# EAGLE schematic odd_v1 (EAGLE 6.2)
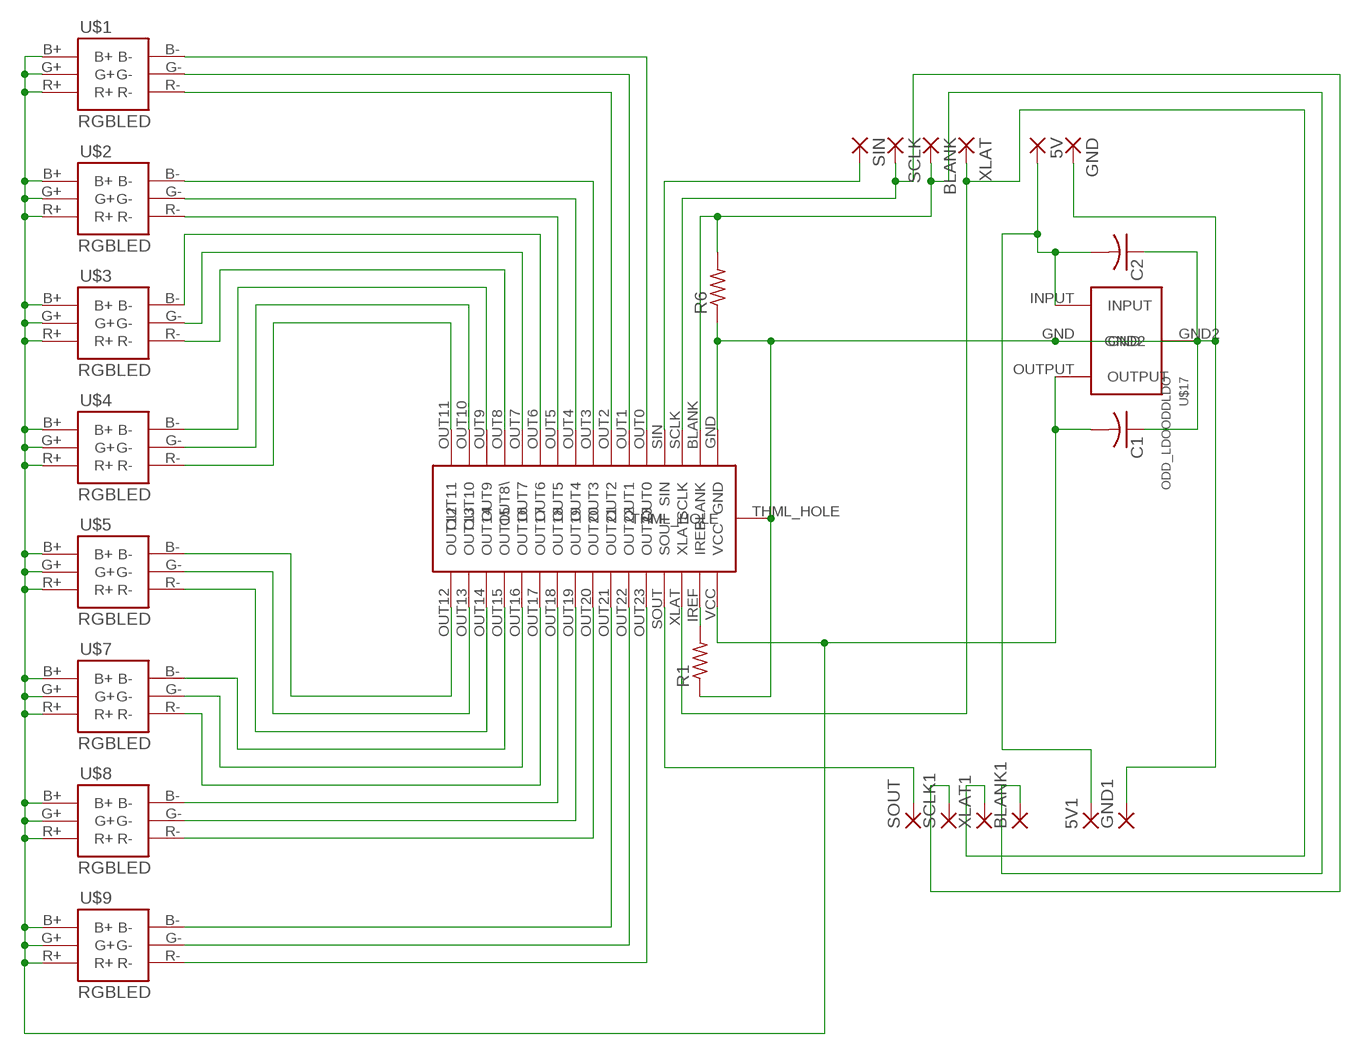
[diagram p0: schematic, sheet 1]

## Parts
5V  2,54/1,1  [2,54/1,1]
5V1  2,54/1,1  [2,54/1,1]
BLANK  2,54/1,1  [2,54/1,1]
BLANK1  2,54/1,1  [2,54/1,1]
C1  C-US050-025X075  [C050-025X075]
C2  C-US050-025X075  [C050-025X075]
GND  2,54/1,1  [2,54/1,1]
GND1  2,54/1,1  [2,54/1,1]
R1  R-US_0204/7  [0204/7]
R6  R-US_0204/7  [0204/7]
SCLK  2,54/1,1  [2,54/1,1]
SCLK1  2,54/1,1  [2,54/1,1]
SIN  2,54/1,1  [2,54/1,1]
SOUT  2,54/1,1  [2,54/1,1]
U$1  RGBLED  CREESMDRGBLED6PADSMD  [6PADSMD]
U$2  RGBLED  CREESMDRGBLED6PADSMD  [6PADSMD]
U$3  RGBLED  CREESMDRGBLED6PADSMD  [6PADSMD]
U$4  RGBLED  CREESMDRGBLED6PADSMD  [6PADSMD]
U$5  RGBLED  CREESMDRGBLED6PADSMD  [6PADSMD]
U$6  TLC5947  [32_SMD]
U$7  RGBLED  CREESMDRGBLED6PADSMD  [6PADSMD]
U$8  RGBLED  CREESMDRGBLED6PADSMD  [6PADSMD]
U$9  RGBLED  CREESMDRGBLED6PADSMD  [6PADSMD]
U$17  ODD_LDOODDLDO  [4PINLDO]
XLAT  2,54/1,1  [2,54/1,1]
XLAT1  2,54/1,1  [2,54/1,1]

## Nets
N$2: U$1.B- U$6.OUT0
N$3: U$1.G- U$6.OUT1
N$4: U$1.R- U$6.OUT2
N$5: U$6.OUT23 U$9.R-
N$6: U$6.OUT22 U$9.G-
N$7: U$6.OUT21 U$9.B-
N$8: U$6.OUT20 U$8.R-
N$9: U$6.OUT19 U$8.G-
N$10: U$6.OUT18 U$8.B-
N$11: U$6.OUT17 U$7.R-
N$12: U$6.OUT16 U$7.G-
N$13: U$6.OUT15 U$7.B-
N$14: U$5.R- U$6.OUT14
N$15: U$5.G- U$6.OUT13
N$16: U$5.B- U$6.OUT12
N$17: U$2.B- U$6.OUT3
N$18: U$6.XLAT XLAT1.1(P) XLAT.1(P)
N$19: U$2.G- U$6.OUT4
N$20: U$2.R- U$6.OUT5
N$21: U$3.B- U$6.OUT6
N$22: U$3.G- U$6.OUT7
N$23: U$3.R- U$6.OUT8(OUT8\)
N$24: U$4.B- U$6.OUT9
N$25: U$4.G- U$6.OUT10
N$26: U$4.R- U$6.OUT11
N$27: C1.2 U$1.B+ U$1.G+ U$1.R+ U$2.B+ U$2.G+ U$2.R+ U$3.B+ U$3.G+ U$3.R+ U$4.B+ U$4.G+ U$4.R+ U$5.B+ U$5.G+ U$5.R+ U$6.VCC U$7.B+ U$7.G+ U$7.R+ U$8.B+ U$8.G+ U$8.R+ U$9.B+ U$9.G+ U$9.R+ U$17.OUTPUT
N$28: 5V1.1(P) 5V.1(P) C2.2 U$17.INPUT
N$29: SIN.1(P) U$6.SIN
N$30: SCLK1.1(P) SCLK.1(P) U$6.SCLK
N$32: R1.2 U$6.IREF
N$33: BLANK1.1(P) BLANK.1(P) R6.2 U$6.BLANK
N$34: C1.1 C2.1 GND1.1(P) GND.1(P) R1.1 R6.1 U$6.GND U$6.THML_HOLE U$17.GND U$17.GND2
N$35: SOUT.1(P) U$6.SOUT

## Library data of the parts
5V 5V1 BLANK BLANK1 GND GND1 SCLK SCLK1 SIN SOUT XLAT XLAT1 = wirepad:2,54/1,1: THROUGH-HOLE PAD
C1 C2 = resistor:C-US: CAPACITOR, American symbol
R1 R6 = resistor:R-US_: RESISTOR, American symbol
U$1-U$5 U$7-U$9 = odd_led:CREESMDRGBLED
U$6 = tlc5947:TLC5947
U$17 = ODD_LDO:ODD_LDO